# Altium project hai.PrjPcb
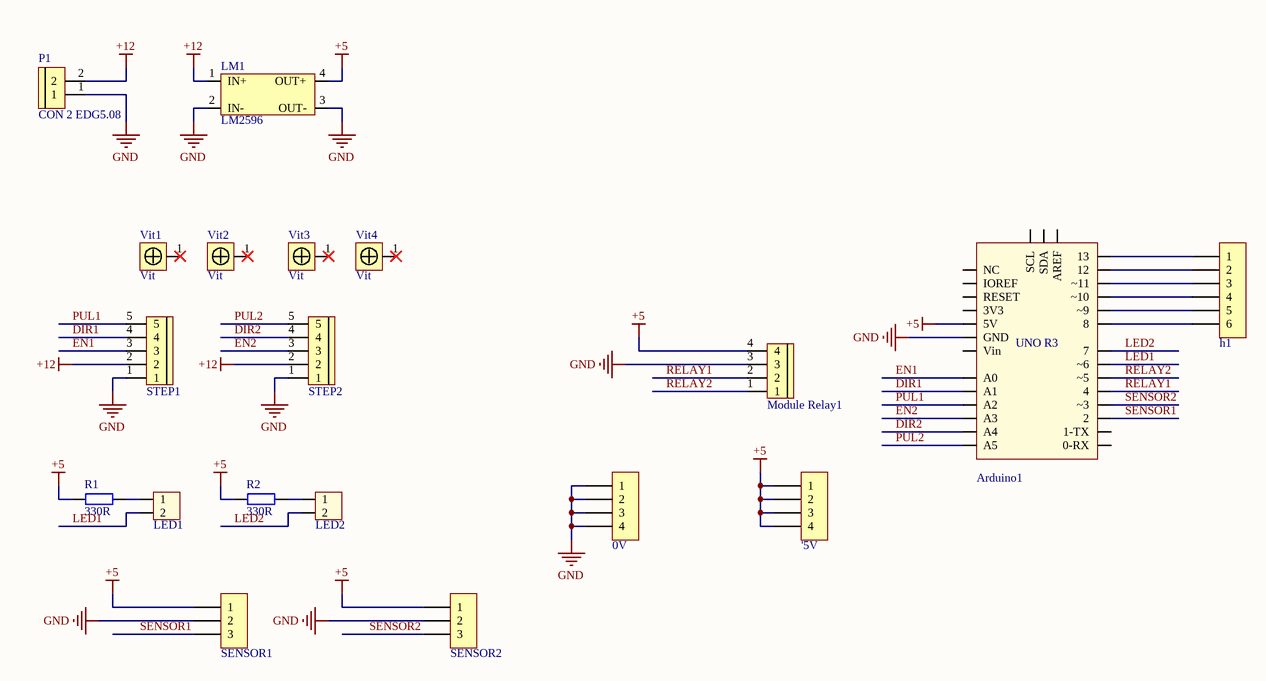
[diagram p0: Sheet1.SchDoc]
1 sheet, 19 parts. Net scope: global (net labels, ports and power ports of the same name join across sheets).
Board file: PCB1.PcbDoc

## Sheet Sheet1.SchDoc
size A4

### Parts
Arduino1  Arduino Uno R3  [Arduino UNO R3]  (value not drawn)
H1  h1  [XH2.54M-6]
H2  0V  [XH2.54M-4]
H3  '5V  [XH2.54M-4]
H4  LED1  [XH2.54M-2]
H5  LED2  [XH2.54M-2]
H6  SENSOR1  [XH2.54M-3]
H7  SENSOR2  [XH2.54M-3]
LM1  LM2596  [LM2596_Module]
Module_Relay1  CON 4 EDG5.08  [CON 4 4EDG5.08]  (value not drawn)
P1  CON 2 EDG5.08  [CON 2 2EDG5.08]
R1  330R  [tro vach 1/4w]
R2  330R  [tro vach 1/4w]
STEP1  CON 5 EDG5.08  [CON 5 5EDG5.08]  (value not drawn)
STEP2  CON 5 EDG5.08  [CON 5 5EDG5.08]  (value not drawn)
Vit1  Vit  [Vit M3]
Vit2  Vit  [Vit M3]
Vit3  Vit  [Vit M3]
Vit4  Vit  [Vit M3]

### Nets
+5: Arduino1.5V H3.1 H3.2 H3.3 H3.4 H6.1 H7.1 LM1.4(OUT+) Module_Relay1.4 R1.1 R2.1
+12: LM1.1(IN+) P1.2 STEP1.2 STEP2.2
GND: Arduino1.GND H2.1 H2.2 H2.3 H2.4 H6.2 H7.2 LM1.2(IN-) LM1.3(OUT-) Module_Relay1.3 P1.1 STEP1.1 STEP2.1
DIR1: Arduino1.A1 STEP1.4
DIR2: Arduino1.A4 STEP2.4
EN1: Arduino1.A0 STEP1.3
EN2: Arduino1.A3 STEP2.3
LED1: Arduino1.~6 H4.2
LED2: Arduino1.7 H5.2
PUL1: Arduino1.A2 STEP1.5
PUL2: Arduino1.A5 STEP2.5
RELAY1: Arduino1.4 Module_Relay1.2
RELAY2: Arduino1.~5 Module_Relay1.1
SENSOR1: Arduino1.2 H6.3
SENSOR2: Arduino1.~3 H7.3
NetArduino1_8: Arduino1.8 H1.6
NetArduino1_12: Arduino1.12 H1.2
NetArduino1_13: Arduino1.13 H1.1
NetArduino1_~9: Arduino1.~9 H1.5
NetArduino1_~10: Arduino1.~10 H1.4
NetArduino1_~11: Arduino1.~11 H1.3
NetH4_1: H4.1 R1.2
NetH5_1: H5.1 R2.2

Not connected (* = marked no-connect by the designer): Arduino1 0-RX 1-TX 3V3 AREF IOREF NC RESET SCL SDA Vin; Vit1 1(13)*; Vit2 1(13)*; Vit3 1(13)*; Vit4 1(13)*

### Notes on the sheet
- Title
- Size:
- Date:
- A4
- Number:
- Time:
- Revision:
- Sheet
- of
- File:
- (in symbol Arduino Uno R3) UNO R3

### Library data of the parts
Arduino1 = Arduino Uno R3: Value: Cau 1A
H1 = Header 6P 2.54 Duc Thang: Cắm; Ten_Linh_Kien: Header 6P XH2.54-6P Đực Thẳng; Don_Vi: Con; Ma_Hang: MH001972; Chung_Loai: Cắm
H2 H3 = Header 4P 2.54 Duc Thang: Cắm; Ten_Linh_Kien: Header 4P XH2.54-4P Đực Thẳng; Don_Vi: Con; Ma_Hang: MH001285; Chung_Loai: Cắm
H4 H5 = Header 2P 2.54 Duc Thang: Cắm; Ten_Linh_Kien: Header 2P XH2.54-2P Đực Thẳng; Don_Vi: Con; Ma_Hang: MH001283; Chung_Loai: Cắm
H6 H7 = Header 3P 2.54 Duc Thang: Cắm; Ten_Linh_Kien: Header 3P XH2.54-3P Đực Thẳng; Don_Vi: Con; Ma_Hang: MH001292; Chung_Loai: Cắm
LM1 = LM2596_Module
Module_Relay1 = CON 4 EDG5.08: Cắm; Ten_Linh_Kien: CON 4 2EDG5.08-4P 5.08MM ( Xanh Cong); Ma_Hang: MH000979; Don_Vi: Con; Ghi_Chu: *; Kieu_Chan: *; Chung_Loai: Cắm
P1 = CON 2 EDG5.08: Cắm; Ten_Linh_Kien: CON 2 2EDG5.08-2P 5.08MM ( Xanh Cong); Ma_Hang: MH000759; Ghi_Chu: *; Don_Vi: Con; Kieu_Chan: *; Chung_Loai: Cắm
R1 R2 = Tro Vach 1/4W 1% 330R: Cắm; Don_Vi: Con; So_Chan: 2; Ten_Linh_Kien: Trở Vạch 1/4w 1% 330R; Ma_Hang: MH006348; Chung_Loai: Cắm; Kieu_Chan: *
STEP1 STEP2 = CON 5 EDG5.08: Cắm; Ten_Linh_Kien: CON 5 2EDG5.08-5P 5.08MM ( Xanh Cong); Ma_Hang: MH003589; Kieu_Chan: *; Don_Vi: Con; Ghi_Chu: *; Chung_Loai: Cắm